# Altium project WIoT_AM01_V100.PrjPcb
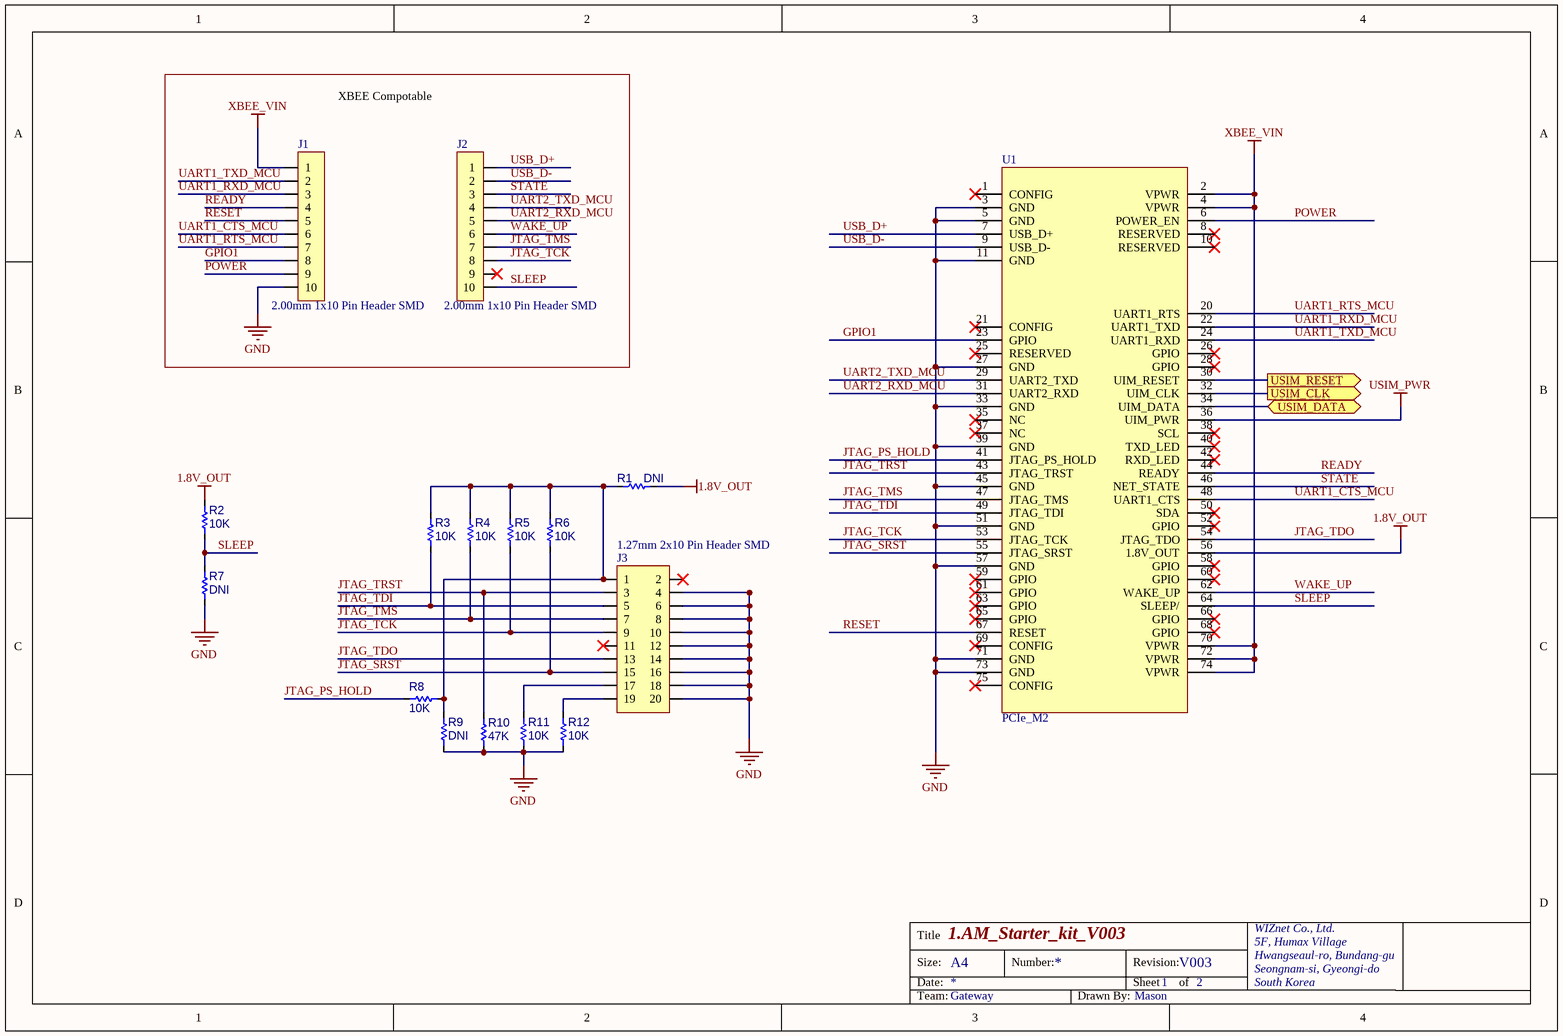
[diagram p0: 1.AMM592.SchDoc]
2 sheets, 31 parts. Net scope: flat (ports and power ports of the same name join across sheets).
Board file: WIoT_AM01_V100.PcbDoc
Sheets:
  1.AMM592.SchDoc
  2.SIM.SchDoc

## Sheet 1.AMM592.SchDoc: 1.AM_Starter_kit_V003
size A4; DrawnBy: Mason; Revision: V003; SheetNumber: 1; SheetTotal: 2; Team: Gateway; ProjectName: AM_Starter_kit_V003

### Parts
J1  2.00mm 1x10 Pin Header SMD  [IDC(SMD)-1X10(2MM)]
J2  2.00mm 1x10 Pin Header SMD  [IDC(SMD)-1X10(2MM)]
J3  1.27mm 2x10 Pin Header SMD  [IDC(SMD)-2X10(1.27MM)]
R1  DNI  [RES-0402]
R2  10K  [RES-0402]
R3  10K  [RES-0402]
R4  10K  [RES-0402]
R5  10K  [RES-0402]
R6  10K  [RES-0402]
R7  DNI  [RES-0402]
R8  10K  [RES-0402]
R9  DNI  [RES-0402]
R10  47K  [RES-0402]
R11  10K  [RES-0402]
R12  10K  [RES-0402]
U1  PCIe_M2  [PCIe_M2]

### Ports
USIM_CLK (out), USIM_DATA (bidir), USIM_RESET (out)

### Nets
1.8V_OUT: R1.1 R2.2 U1.56(1.8V_OUT)
GND: J1.10 J3.4 J3.6 J3.8 J3.10 J3.12 J3.14 J3.16 J3.18 J3.20 R7.1 R9.1 R10.1 R11.1 R12.1 U1.3(GND) U1.5(GND) U1.11(GND) U1.27(GND) U1.33(GND) U1.39(GND) U1.45(GND) U1.51(GND) U1.57(GND) U1.71(GND) U1.73(GND)
USIM_PWR: U1.36(UIM_PWR)
XBEE_VIN: J1.1 U1.2(VPWR) U1.4(VPWR) U1.70(VPWR) U1.72(VPWR) U1.74(VPWR)
GPIO1: J1.8 U1.23(GPIO)
JTAG_PS_HOLD: R8.2 U1.41(JTAG_PS_HOLD)
JTAG_SRST: J3.15 R6.1 U1.55(JTAG_SRST)
JTAG_TCK: J2.8 J3.9 R5.1 U1.53(JTAG_TCK)
JTAG_TDI: J3.5 R3.1 U1.49(JTAG_TDI)
JTAG_TDO: J3.13 U1.54(JTAG_TDO)
JTAG_TMS: J2.7 J3.7 R4.1 U1.47(JTAG_TMS)
JTAG_TRST: J3.3 R10.2 U1.43(JTAG_TRST)
POWER: J1.9 U1.6(POWER_EN)
READY: J1.4 U1.44(READY)
RESET: J1.5 U1.67(RESET)
SLEEP: J2.10 R2.1 R7.2 U1.64(SLEEP/)
STATE: J2.3 U1.46(NET_STATE)
UART1_CTS_MCU: J1.6 U1.48(UART1_CTS)
UART1_RTS_MCU: J1.7 U1.20(UART1_RTS)
UART1_RXD_MCU: J1.3 U1.22(UART1_TXD)
UART1_TXD_MCU: J1.2 U1.24(UART1_RXD)
UART2_RXD_MCU: J2.5 U1.31(UART2_RXD)
UART2_TXD_MCU: J2.4 U1.29(UART2_TXD)
USB_D+: J2.1 U1.7(USB_D+)
USB_D-: J2.2 U1.9(USB_D-)
WAKE_UP: J2.6 U1.62(WAKE_UP)
NetJ3_1: J3.1 R1.2 R3.2 R4.2 R5.2 R6.2 R8.1 R9.2
NetJ3_17: J3.17 R11.2
NetJ3_19: J3.19 R12.2
NetR13_1: U1.30(UIM_RESET) ; port USIM_RESET
NetR14_1: U1.32(UIM_CLK) ; port USIM_CLK
NetR15_1: U1.34(UIM_DATA) ; port USIM_DATA

Not connected (* = marked no-connect by the designer): J2 9*; J3 2* 11*; U1 1(CONFIG)* 8(RESERVED)* 10(RESERVED)* 21(CONFIG)* 25(RESERVED)* 26(GPIO)* 28(GPIO)* 35(NC)* 37(NC)* 38(SCL)* 40(TXD_LED)* 42(RXD_LED)* 50(SDA)* 52(GPIO)* 58(GPIO)* 59(GPIO)* 60(GPIO)* 61(GPIO)* 63(GPIO)* 65(GPIO)* 66(GPIO)* 68(GPIO)* 69(CONFIG)* 75(CONFIG)*

### Notes on the sheet
- XBEE Compotable
- Title
- Size:
- Date:
- A4
- Number:
- Revision:
- Sheet
- of
- WIZnet Co., Ltd.
- 5F, Humax Village
- Hwangseaul-ro, Bundang-gu
- Seongnam-si, Gyeongi-do
- South Korea
- Team:
- Drawn By:

### Library data of the parts
R1-R12 = RES-0402
U1 = PCIe-M2

## Sheet 2.SIM.SchDoc: 2.SIM_Interface
size A4; DrawnBy: Mason; Revision: V001; SheetNumber: 2; SheetTotal: 2; Team: Gateway; ProjectName: AM_Starter_kit_V001
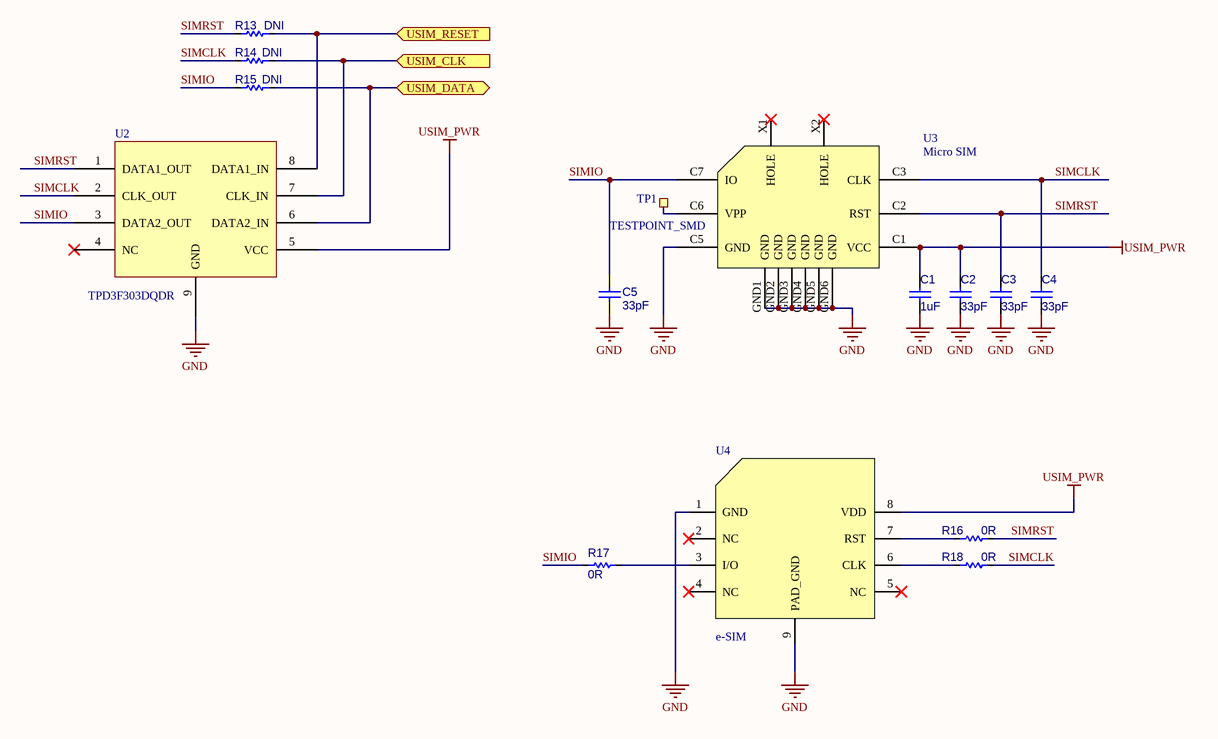
[diagram p1: 2.SIM.SchDoc]

### Parts
C1  1uF  [CAP-0402]
C2  33pF  [CAP-0402]
C3  33pF  [CAP-0402]
C4  33pF  [CAP-0402]
C5  33pF  [CAP-0402]
R13  DNI  [RES-0402]
R14  DNI  [RES-0402]
R15  DNI  [RES-0402]
R16  0R  [RES-0402]
R17  0R  [RES-0402]
R18  0R  [RES-0402]
TP1  TESTPOINT_SMD  [TP(SMD)-1PI]
U2  TPD3F303DQDR  [PWSON08(0.4/1.45X1.8)]
U3  Micro SIM  [0786463001]
U4  e-SIM  [SON08(1.27/6X5)]

### Ports
USIM_CLK (in), USIM_DATA (bidir), USIM_RESET (in)

### Nets
GND: C1.1 C2.1 C3.1 C4.1 C5.1 U2.9(GND) U3.C5(GND) U3.GND1(GND) U3.GND2(GND) U3.GND3(GND) U3.GND4(GND) U3.GND5(GND) U3.GND6(GND) U4.1(GND) U4.9(PAD_GND)
USIM_PWR: C1.2 C2.2 U2.5(VCC) U3.C1(VCC) U4.8(VDD)
SIMCLK: C4.2 R14.2 R18.2 U2.2(CLK_OUT) U3.C3(CLK)
SIMIO: C5.2 R15.2 R17.1 U2.3(DATA2_OUT) U3.C7(IO)
SIMRST: C3.2 R13.2 R16.2 U2.1(DATA1_OUT) U3.C2(RST)
NetR13_1: R13.1 U2.8(DATA1_IN) ; port USIM_RESET
NetR14_1: R14.1 U2.7(CLK_IN) ; port USIM_CLK
NetR15_1: R15.1 U2.6(DATA2_IN) ; port USIM_DATA
NetR16_1: R16.1 U4.7(RST)
NetR17_2: R17.2 U4.3(I/O)
NetR18_1: R18.1 U4.6(CLK)
NetTP1_1: TP1.1(TETSPOINT) U3.C6(VPP)

Not connected (* = marked no-connect by the designer): U2 4(NC)*; U3 X1(HOLE)* X2(HOLE)*; U4 2(NC)* 4(NC)* 5(NC)*

### Notes on the sheet
- Title
- Size:
- Date:
- A4
- Number:
- Revision:
- Sheet
- of
- WIZnet Co., Ltd.
- 5F, Humax Village
- Hwangseaul-ro, Bundang-gu
- Seongnam-si, Gyeongi-do
- South Korea
- Team:
- Drawn By:

### Library data of the parts
C1-C5 = CAP-0402: Ceramic CAP 0402(1005)
R13-R18 = RES-0402
TP1 = TESTPOINT_SMD: TEST POINT
U2 = TPD3F303DQDR: ESD Protection SIM
U3 = Micro SIM: Micro SIM SMT 1.45mm Push/Pull

## Nets that join several sheets
GND: 1.AMM592 (26 pins), 2.SIM (15 pins)
USIM_PWR: 1.AMM592 (U1.36), 2.SIM (5 pins)
NetR13_1: 1.AMM592 (U1.30), 2.SIM (R13.1 U2.8)
NetR14_1: 1.AMM592 (U1.32), 2.SIM (R14.1 U2.7)
NetR15_1: 1.AMM592 (U1.34), 2.SIM (R15.1 U2.6)